# EAGLE design motionManager (EAGLE 9.0.1)
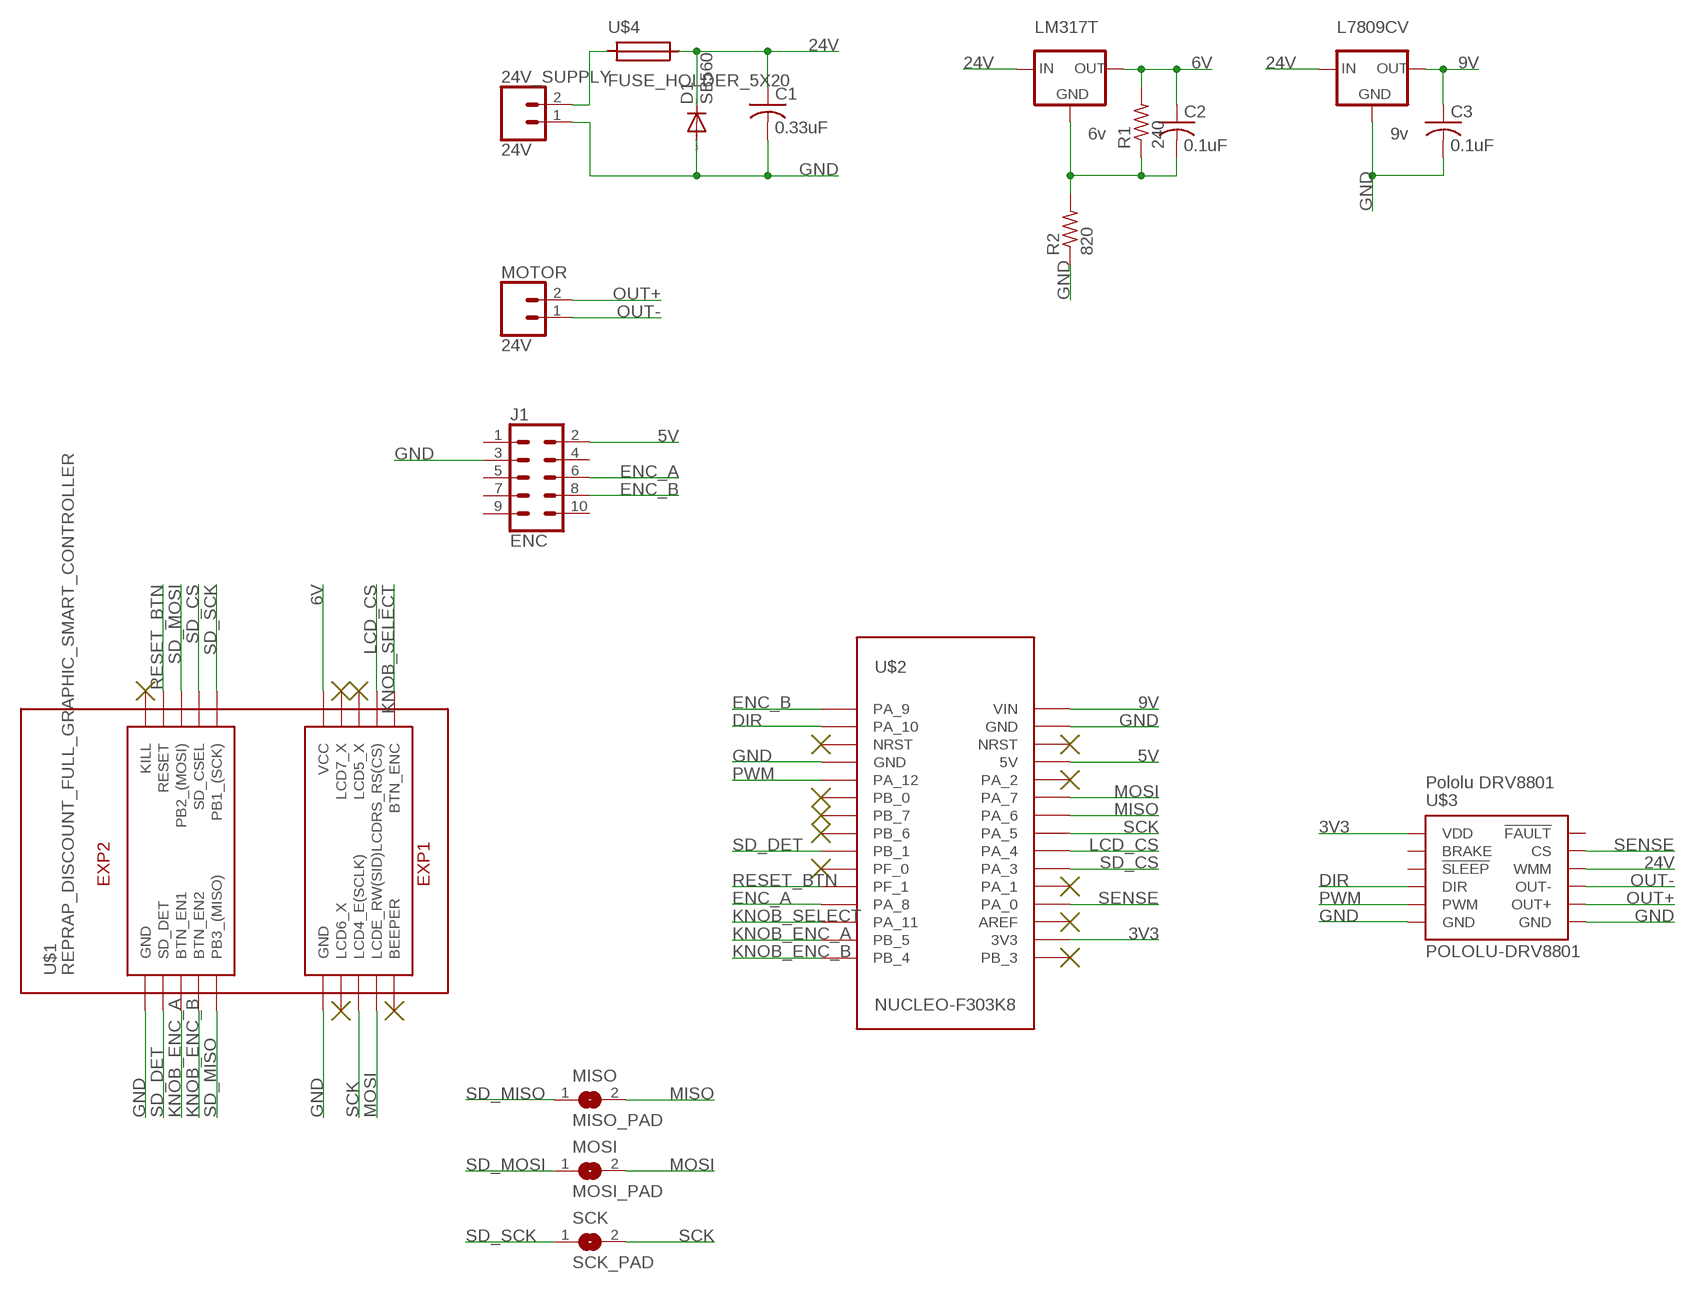
[diagram p0: schematic, sheet 1]

## Parts
24V_SUPPLY  24V  CONN_025MM  [SCREWTERMINAL-5MM-2]
C1  0.33uF  C-US025_050-055X075  [C025_050-055X075]
C2  0.1uF  C-US025_050-055X075  [C025_050-055X075]
C3  0.1uF  C-US025_050-055X075  [C025_050-055X075]
D1  SB560  SB320  [DO201-15]
J1  ENC  CONN_05X2SHD-NS  [2X5-SHROUDED-NS]
L7809CV  9v  78XXL  [78XXL]
LM317T  6v  78XXL  [78XXL]
MISO  MISO_PAD  SJW  [SJW]
MOSI  MOSI_PAD  SJW  [SJW]
MOTOR  24V  CONN_025MM  [SCREWTERMINAL-5MM-2]
R1  240  R-US_0207/7  [0207/7]
R2  820  R-US_0207/7  [0207/7]
SCK  SCK_PAD  SJW  [SJW]
U$1  REPRAP_DISCOUNT_FULL_GRAPHIC_SMART_CONTROLLER  [REPRAP_DISCOUNT_FULL_GRAPHIC_SMART_CONTROLLER]
U$2  NUCLEO-F303K8  [NUCLEO-F303K8]
U$3  POLOLU-DRV8801  [POLOLU-DRV8801]
U$4  FUSE_HOLDER_5X20  [FUSE_HOLDER_5X20]

## Nets
3V3: U$2.3V3 U$3.VDD
5V: J1.2 U$2.5V
6V: C2.1 LM317T.OUT R1.2 U$1.VCC
9V: C3.1 L7809CV.OUT U$2.VIN
24V: C1.1 D1.C L7809CV.IN LM317T.IN U$3.VMM(WMM) U$4.P$2
DIR: U$2.PA_10 U$3.DIR
ENC_A: J1.6 U$2.PA_8
ENC_B: J1.8 U$2.PA_9
GND: 24V_SUPPLY.1 C1.2 C3.2 D1.A J1.3 L7809CV.GND R2.1 U$1.GND@0(GND) U$1.GND@1(GND) U$2.GND@0(GND) U$2.GND@1(GND) U$3.GND@1(GND) U$3.GND@2(GND)
KNOB_ENC_A: U$1.BTN_EN1 U$2.PB_5
KNOB_ENC_B: U$1.BTN_EN2 U$2.PB_4
KNOB_SELECT: U$1.BTN_ENC U$2.PA_11
LCD_CS: U$1.LCDRS_RS(CS) U$2.PA_4
MISO: MISO.2 U$2.PA_6
MOSI: MOSI.2 U$1.LCDE_RW(SID) U$2.PA_7
N$2: 24V_SUPPLY.2 U$4.P$1
N$3: C2.2 LM317T.GND R1.1 R2.2
OUT+: MOTOR.2 U$3.OUT+
OUT-: MOTOR.1 U$3.OUT-
PWM: U$2.PA_12 U$3.PWM
RESET_BTN: U$1.RESET U$2.PF_1
SCK: SCK.2 U$1.LCD4_E(SCLK) U$2.PA_5
SD_CS: U$1.SD_CSEL U$2.PA_3
SD_DET: U$1.SD_DET U$2.PB_1
SD_MISO: MISO.1 U$1.PB3_(MISO)
SD_MOSI: MOSI.1 U$1.PB2_(MOSI)
SD_SCK: SCK.1 U$1.PB1_(SCK)
SENSE: U$2.PA_0 U$3.CS
Unconnected: J1.1 J1.4 J1.5 J1.7 J1.9 J1.10 U$1.BEEPER U$1.KILL U$1.LCD5_X U$1.LCD6_X U$1.LCD7_X U$2.AREF U$2.NRST@0(NRST) U$2.NRST@1(NRST) U$2.PA_1 U$2.PA_2 U$2.PB_0 U$2.PB_3 U$2.PB_6 U$2.PB_7 U$2.PF_0 U$3.!FAULT U$3.!SLEEP U$3.BRAKE

## Library data of the parts
24V_SUPPLY MOTOR = SparkFun-Connectors:CONN_02: Multi connection point. Often used as Generic Header-pin footprint for 0.1 inch spaced/style header connections On any of the 0.1 inch spaced packages, you can populate with these: Break Away Headers - Straight <https://www.sparkfun.com/products/116> (PRT-00116) Break Away Male Headers - Right Angle <https://www.sparkfun.com/products/553> (PRT-00553) Female Headers <https://www.sparkfun.com/products/115> (PRT-00115) Break Away Headers - Machine Pin <https://www.sparkfun.com/products/117> (PRT-00117) Break Away Female Headers - Swiss Machine Pin <https://www.sparkfun.com/products/743> (PRT-00743) For SCREWTERMINALS and SPRING TERMINALS visit here: Screw Terimnals on SparkFun.com <https://www.sparkfun.com/search/results?term=Screw+Terminals> (5mm/3.5mm/2.54mm spacing) This device is also useful as a general connection point to wire up your design to another part of your project. Our various solder wires solder well into these plated through hole pads. Hook-Up Wire - Assortment (Stranded, 22 AWG) <https://www.sparkfun.com/products/11375> (PRT-11375) Hook-Up Wire - Assortment (Solid Core, 22 AWG) <https://www.sparkfun.com/products/11367> (PRT-11367) View the entire wire category on our website here <https://www.sparkfun.com/categories/141> Special notes: Molex polarized connector foot print use with: PRT-08233 with associated crimp pins and housings. 2.54_SCREWTERM for use with PRT-10571. 3.5mm Screw Terminal footprints for PRT-08084 5mm Screw Terminal footprints for use with PRT-08432; SF_SKU: PRT-08432
C1-C3 = adafruit:C-US: CAPACITOR, American symbol
D1 = diode:SB320: DIODE barrier rectifier, 3 A (Fairchild)
J1 = SparkFun-Connectors:CONN_05X2: Multi connection point. Often used as Generic Header-pin footprint for 0.1 inch spaced/style header connections For AVR SPI programming port, see special device with nice symbol: "AVR_SPI_PROG_5x2.dev" You can populate with any combo of single row headers, but if you'd like an exact match, check these: 2x5 AVR ICSP Male Header <https://www.sparkfun.com/products/778> (PRT-00778) 2x5 Pin Shrouded Header <https://www.sparkfun.com/products/8506> (PRT-08506) On any of the 0.1 inch spaced packages, you can populate with these: Break Away Headers - Straight <https://www.sparkfun.com/products/116> (PRT-00116) Break Away Male Headers - Right Angle <https://www.sparkfun.com/products/553> (PRT-00553) Female Headers <https://www.sparkfun.com/products/115> (PRT-00115) Break Away Headers - Machine Pin <https://www.sparkfun.com/products/117> (PRT-00117) Break Away Female Headers - Swiss Machine Pin <https://www.sparkfun.com/products/743> (PRT-00743) Special note: the shrouded connector mates well with our 5x2 ribbon cables: 2x5 Pin IDC Ribbon Cable <https://www.sparkfun.com/products/8535> (PRT-08535); PROD_ID: CONN-08671; SF_ID: PRT-08506
L7809CV LM317T = v-reg:78XXL: VOLTAGE REGULATOR
MISO MOSI SCK = jumper:SJ: SMD solder JUMPER
R1 R2 = adafruit:R-US_: RESISTOR, American symbol
U$1 = Pamir:REPRAP_DISCOUNT_FULL_GRAPHIC_SMART_CONTROLLER
U$2 = Pamir:NUCLEO-F303K8
U$3 = Pamir:POLOLU-DRV8801: DRV8801 Single Brushed DC Motor Driver Carrier DRV8801 Single Brushed DC Motor Driver Carrier Manufacturer: Pololu Manufacturer Part Number: N/A Description: N/A Technical Specifications: N/A Digikey: N/A Mouser: N/A
U$4 = Pamir:FUSE_HOLDER_5X20

## Board
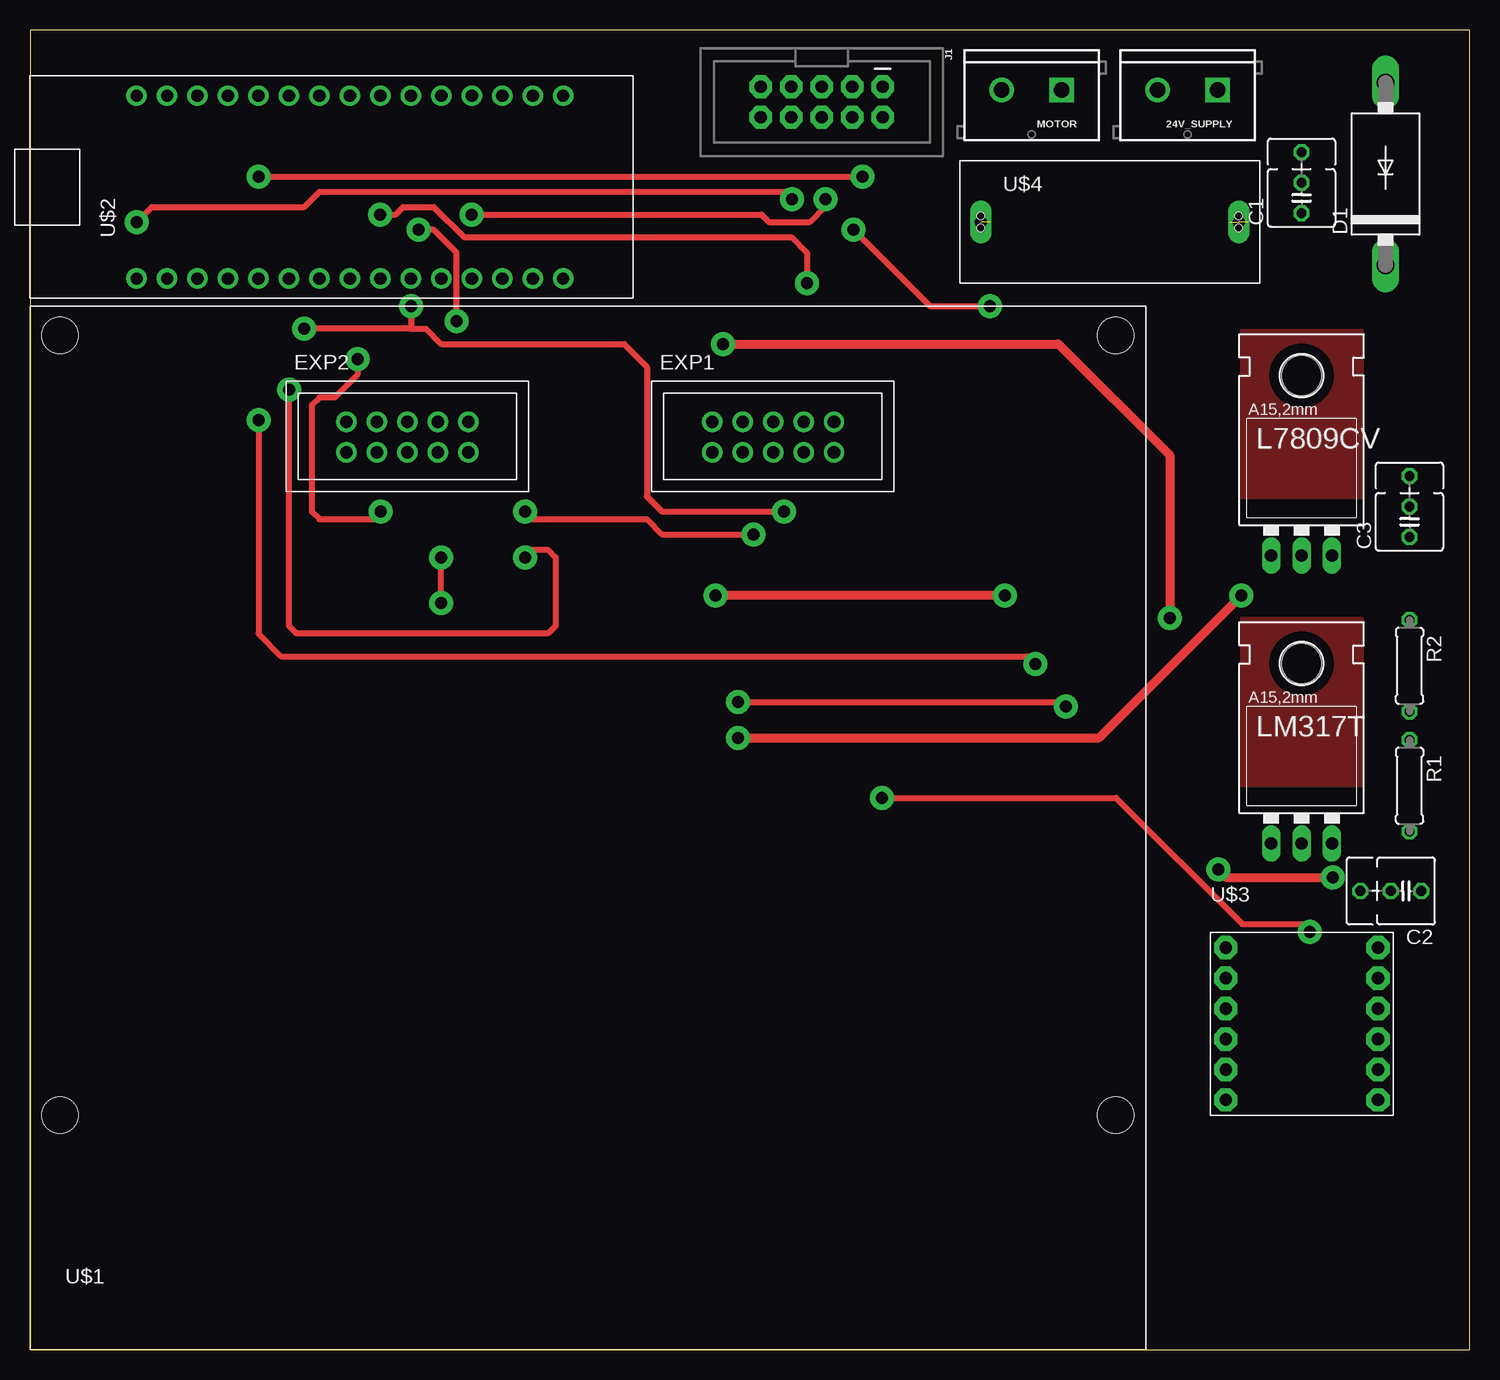
[diagram p1: board, top side]
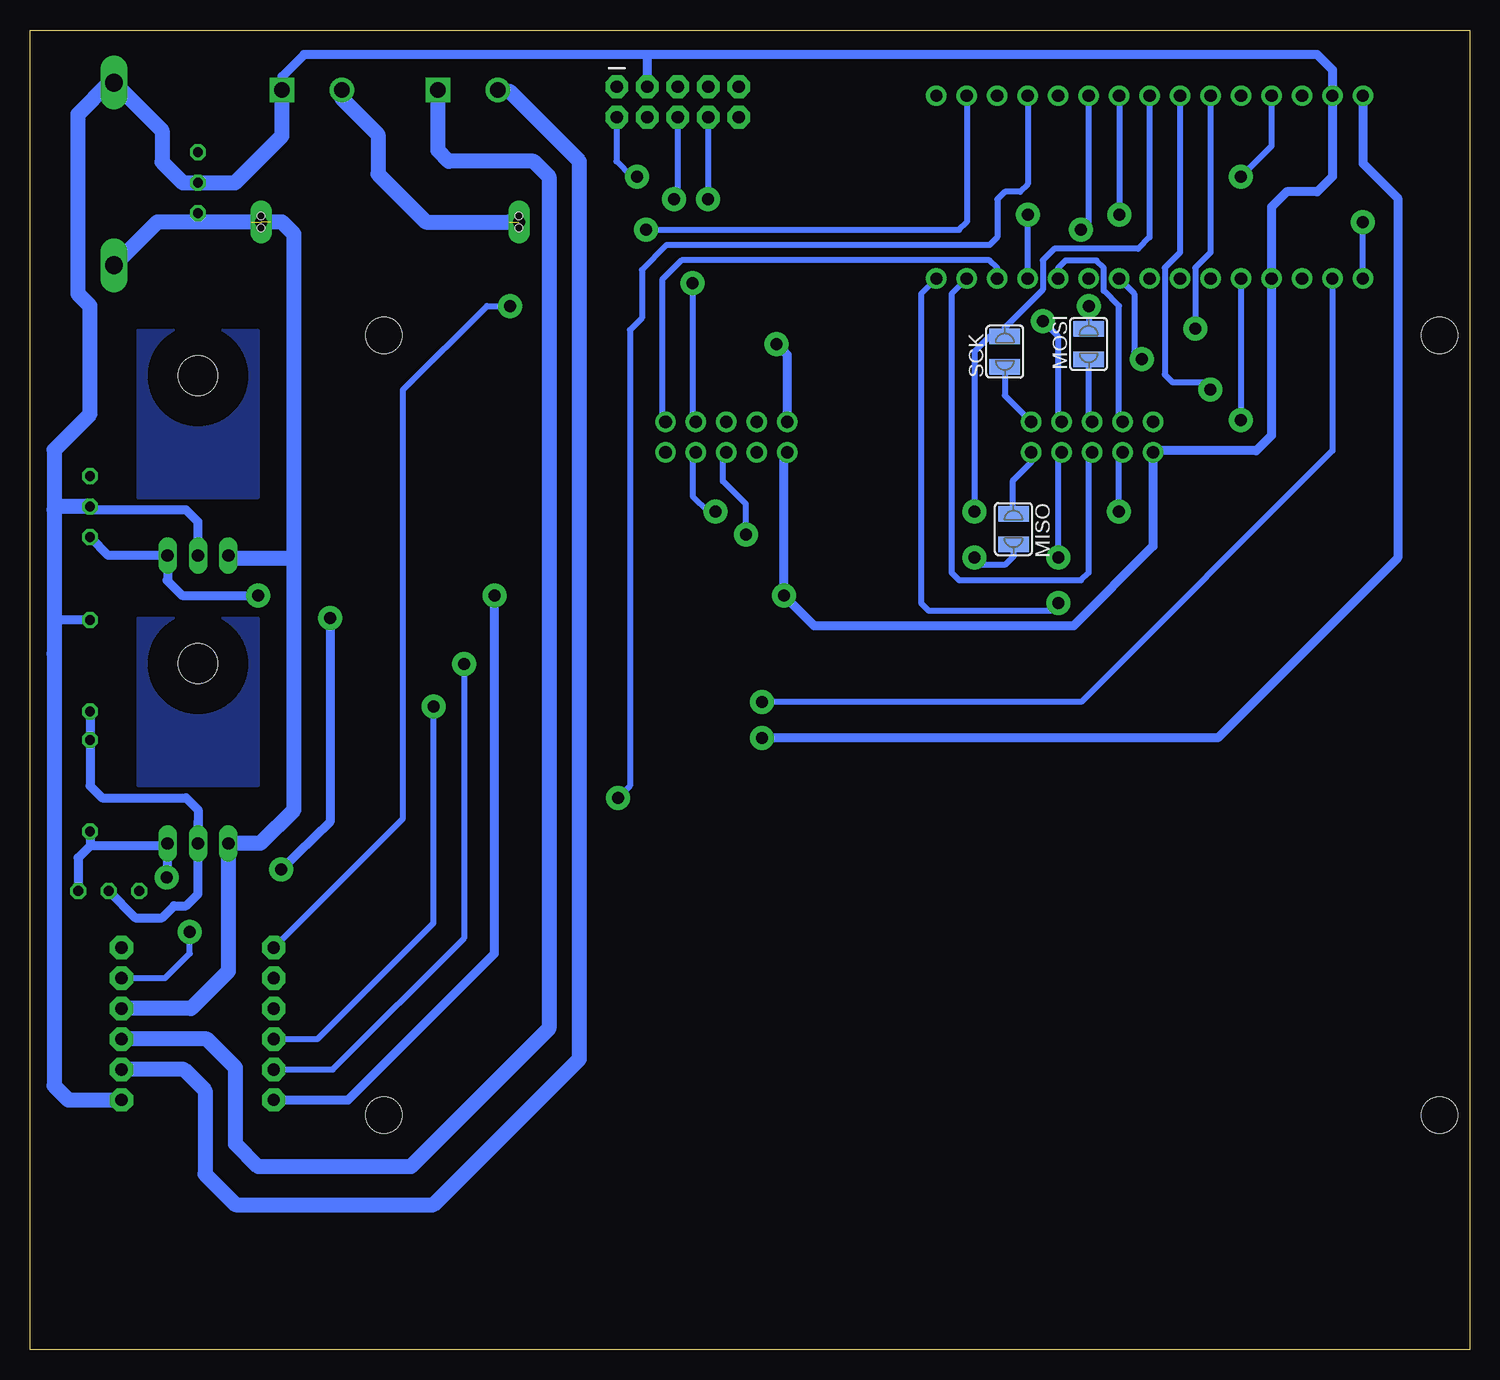
[diagram p2: board, bottom side, seen from below]

Size 120 x 110 mm. Coordinates in mm from the lower left corner, seen from the top.
Outline: 0,0 120,0 120,110 0,110 0,0
Copper layers (1*16): Top 0.035mm / dielectric 1.5mm / Bottom 0.035mm
Design rules "default *": minimum track width 6mil, minimum drill 0.35mm, track to track 6mil, track to pad 6mil, pad to pad 6mil, via to via 6mil, smd to smd 6mil, copper to edge 40mil, drill to drill 6mil, minimum pad ring 10mil, minimum via ring 8mil, stop-mask expansion 4mil, vias tented up to drill 0mil, thermal gap 10mil

### Footprints (pad centres in the part's own frame; a part is rotated, then mirrored left to right if it is on the bottom)
SCREWTERMINAL-5MM-2 = drill 1.3 pad 2.032 square: 1 0,0 | drill 1.3 pad 2.032: 2 5,0
C025_050-055X075 = drill 0.813 octagon: 1 -1.27,0; 2 1.27,0; 3 3.81,0
DO201-15 = drill 1.499 long: A 7.62,0; C -7.62,0
2X5-SHROUDED-NS = drill 1.016 pad 1.88 octagon: 1 -1.27,5.08; 2 1.27,5.08; 3 -1.27,2.54; 4 1.27,2.54; 5 -1.27,0; 6 1.27,0; 7 -1.27,-2.54; 8 1.27,-2.54; 9 -1.27,-5.08; 10 1.27,-5.08
78XXL = drill 1.016 long: GND 0,-3.81; IN -2.54,-3.81; OUT 2.54,-3.81 | hole 3.302: 0,11.176
SJW = smd 1.27 x 2.54: 1 -1.27,0; 2 1.27,0
0207/7 = drill 0.813 octagon: 1 -3.81,0; 2 3.81,0
REPRAP_DISCOUNT_FULL_GRAPHIC_SMART_CONTROLLER = drill 1.05 pad 1.7: BEEPER 20.524,31.297; BTN_EN1 -15.036,31.297; BTN_EN2 -12.496,31.297; BTN_ENC 20.524,33.837; GND@0 -20.116,31.297; GND@1 10.364,31.297; KILL -20.116,33.837; LCD4_E(SCLK) 15.444,31.297; LCD5_X 15.444,33.837; LCD6_X 12.904,31.297; LCD7_X 12.904,33.837; LCDE_RW(SID) 17.984,31.297; LCDRS_RS(CS) 17.984,33.837; PB1_(SCK) -9.956,33.837; PB2_(MOSI) -15.036,33.837; PB3_(MISO) -9.956,31.297; RESET -17.576,33.837; SD_CSEL -12.496,33.837; SD_DET -17.576,31.297; VCC 10.364,33.837 | hole 3: -44,41.037; 44,41.037; -44,-23.963; 44,-23.963
NUCLEO-F303K8 = drill 1.02 pad 1.7: 3V3 16.891,8.382; 5V 16.891,33.782; AREF 16.891,10.922; GND@0 1.651,33.782; GND@1 16.891,38.862; NRST@0 1.651,36.322; NRST@1 16.891,36.322; PA_0 16.891,13.462; PA_1 16.891,16.002; PA_2 16.891,31.242; PA_3 16.891,18.542; PA_4 16.891,21.082; PA_5 16.891,23.622; PA_6 16.891,26.162; PA_7 16.891,28.702; PA_8 1.651,13.462; PA_9 1.651,41.402; PA_10 1.651,38.862; PA_11 1.651,10.922; PA_12 1.651,31.242; PB_0 1.651,28.702; PB_1 1.651,21.082; PB_3 16.891,5.842; PB_4 1.651,5.842; PB_5 1.651,8.382; PB_6 1.651,23.622; PB_7 1.651,26.162; PF_0 1.651,18.542; PF_1 1.651,16.002; VIN 16.891,41.402
POLOLU-DRV8801 = drill 1.016 pad 1.93 octagon: !FAULT 6.35,6.35; !SLEEP -6.35,1.27; BRAKE -6.35,3.81; CS 6.35,3.81; DIR -6.35,-1.27; GND@1 -6.35,-6.35; GND@2 6.35,-6.35; OUT+ 6.35,-3.81; OUT- 6.35,-1.27; PWM -6.35,-3.81; VDD -6.35,6.35; VMM 6.35,1.27
FUSE_HOLDER_5X20 = drill 1 pad 1.8 long: P$1 -10.75,0; P$2 10.75,0 | hole 0.6: -10.75,0.5; -10.75,-0.5; 10.75,-0.5; 10.75,0.5

### Placement (x,y rotation side)
24V_SUPPLY  99,105 180 top
C1  106,96 90 top
C2  114.71,38.22 180 top
C3  115,69 90 top
D1  113,98 90 top
J1  66,104 270 top
L7809CV  106,70 0 top
LM317T  106,46 0 top
MISO  38.02,68.4 270 bottom
MOSI  31.75,83.82 90 bottom
MOTOR  86,105 180 top
R1  115,47 270 top
R2  115,57 270 top
SCK  38.73,83.19 90 bottom
U$1  46.5,43.5 0 top
U$2  50.29,87.63 90 top
U$3  106.03,27.15 0 top
U$4  90,94 0 top

### Tracks (layer width: path | path; a pad name or v marks a point on that pad's centre or on a via)
3V3  (via drill 1 pad 2)
  Top 0.508: v68.66,93.34 75,87 v80,87
  Bottom 0.508: U$2.3V3 41.91,93.98 42.55,93.34 v68.66,93.34 | U$3.VDD 88.9,44.28 88.9,80.01 81.92,87 v80,87
5V  (via drill 1 pad 2)
  Top 0.508: v19.05,97.79 v69.41,97.79
  Bottom 0.508: U$2.5V 16.51,100.33 v19.05,97.79 | v69.41,97.79 69.85,97.79 71.12,99.06 71.08,99.1 J1.2
6V  (via drill 1 pad 2)
  Top 0.762: v57.78,83.82 85.72,83.82 95,74.55 v95,61 | v99.06,40.01 99.69,39.37 v108.58,39.37
  Bottom 0.762: U$1.VCC 56.86,82.9 v57.78,83.82 | v95,61 95,44 v99.06,40.01 | v108.58,39.37 108.54,39.41 108.54,42 | 108.54,42 LM317T.OUT | R1.2 114.98,43.17 114.98,42 | 108.54,42 114.98,42 | 114.98,42 115.98,41 116,41 116,38.24 C2.1
9V  (via drill 1 pad 2)
  Top 0.762: v59,51 89.1,51 v100.97,62.87
  Bottom 0.762: v100.97,62.87 107.31,62.87 108.58,64.14 108.54,64.18 L7809CV.OUT 113.46,66.19 C3.1 | U$2.VIN 8.89,98.89 6,96 6,66 21,51 v59,51
24V  (2 unrouted)
  Bottom 1.27: 98,66 98,45 100.81,42.19 LM317T.IN 103.46,31.54 106.58,28.42 U$3.VMM | 98,66 98,93 99,94 99.93,94 | L7809CV.IN 103.27,66 98,66 | 106,94 C1.1 | 101.57,94 106,94 | D1.C 109.38,94 106,94
DIR  (via drill 1 pad 2)
  Top 0.508: v59,54 86,54 86.36,53.64 v86.36,53.61
  Bottom 0.508: U$3.DIR 96.04,25.88 86.36,35.56 v86.36,53.61 | U$2.PA_10 11.43,74.93 32.36,54 v59,54
ENC_A  (via drill 1 pad 2)
  Top 0.508: v36.83,94.61 60.96,94.61 61.59,93.98 61.62,94 65,94 66.31,95.31 v66.31,95.89
  Bottom 0.508: U$2.PA_8 36.83,93.34 v36.83,94.61 | v66.31,95.89 66,96.19 J1.6
ENC_B  (via drill 1 pad 2)
  Top 0.508: v8.89,93.98 10.16,95.25 22.86,95.25 24.13,96.52 62.87,96.52 v63.5,95.89
  Bottom 0.508: J1.8 63.5,102.69 v63.5,95.89 | U$2.PA_9 v8.89,93.98
GND  (via drill 1 pad 2)
  Top 0.762: v81.28,62.87 v57.15,62.87
  Bottom 0.508: U$2.GND@1 | 16.51,95.25 | U$2.GND@0 | 26.25,74.93 U$1.GND@0
  Bottom 0.762: U$2.GND@1 11.43,97.79 12.7,96.52 15.24,96.52 16.51,95.25 | U$1.GND@1 57.15,74.51 v57.15,62.87 54.61,60.33 33.02,60.33 26.38,66.96 U$1.GND@0 | U$3.GND@1 93.5,20.8 81.28,33.02 v81.28,62.87 | 16.51,95.25 U$2.GND@0 | U$2.GND@0 16.51,76.2 17.78,74.93 26.25,74.93 | U$2.GND@1 11.43,106.68 12.7,107.95 68.58,107.95 | 68.58,107.95 97.16,107.95 99,106.11 24V_SUPPLY.1 | 68.58,107.95 68.54,107.91 J1.3 | R2.1 117.81,60.81 118,58 | L7809CV.GND 106,69 107,70 114.73,70 C3.2
  Bottom 1.27: 118,70 118,75 115,78 115,87 116,88 116,103 113.38,105.62 D1.A 109,101.62 109,99 107.27,97.27 C1.2 102.91,97.27 99,101.17 24V_SUPPLY.1 | C3.2 117.73,70.27 118,70 | U$3.GND@2 116.8,20.8 118,22 118,58 118,70
KNOB_ENC_A
  Bottom 0.508: U$1.BTN_EN1 31.75,74.51 31.75,64.77 32.38,64.14 42.55,64.14 43.18,64.77 43.18,88.01 U$2.PB_5
KNOB_ENC_B  (via drill 1 pad 2)
  Top 0.508: v34.29,62.23 v34.29,66.04
  Bottom 0.508: U$1.BTN_EN2 34.29,74.51 v34.29,66.04 | U$2.PB_4 45.72,88.01 45.72,62.23 45.09,61.59 34.92,61.59 v34.29,62.23
KNOB_SELECT
  Bottom 0.508: U$1.BTN_ENC 67.31,77.62 67.31,89.17 65.67,90.81 40.01,90.81 39.37,90.17 U$2.PA_11
LCD_CS  (via drill 1 pad 2)
  Top 0.508: v29.21,94.62 30.48,94.62 31.11,95.25 33.66,95.25 36.2,92.71 63.5,92.71 64.77,91.44 v64.77,88.9
  Bottom 0.508: U$2.PA_4 v29.21,94.62 | U$1.LCDRS_RS(CS) 64.77,77.62 v64.77,88.9
MISO  (via drill 1 pad 2)
  Top 0.508: v41.27,66.04 41.91,66.67 43.18,66.67 43.81,66.04 43.81,60.33 43.18,59.69 22.23,59.69 21.59,60.33 v21.59,80.01
  Bottom 0.508: U$2.PA_6 24.13,91.44 25.4,90.17 25.4,81.28 24.77,80.64 22.23,80.64 v21.59,80.01 | MISO.2 38.02,66.12 38.73,65.41 40.64,65.41 v41.27,66.04
MOSI  (via drill 1 pad 2)
  Top 0.508: MOSI.2 v22.86,85.09 | v31.75,87 MOSI.2 | MOSI.2 33.02,85.09 34.29,83.82 49.53,83.82 51.44,81.92 51.44,71.12 52.7,69.85 v62.87,69.85
  Bottom 0.508: U$1.LCDE_RW(SID) 64.77,74.51 64.77,71.12 63.5,69.85 v62.87,69.85 | U$2.PA_7 21.59,93.98 | 21.59,93.98 | 21.59,93.98 21.59,91.44 22.86,90.17 v22.86,85.09 | v31.75,87 MOSI.2
N$1
  pour Top: 101,61 111,61 111,47 101,47
N$2  (1 unrouted)
  Bottom 1.27: 24V_SUPPLY.2 94,104.28 91,101.28 91,98 87,94 80.07,94
N$3
  Bottom 0.762: LM317T.GND 106,44 | C2.2 111.22,36 109,36 108,37 107,37 106,38 LM317T.GND | R2.2 R1.1 115,47 114,46 107,46 106,45 LM317T.GND
N$4
  pour Bottom: 101,61 101,47 111,47 111,61
N$5
  pour Top: 101,85 111,85 111,71 101,71
N$6
  pour Bottom: 101,71 111,71 111,85 101,85
OUT+
  Bottom 1.27: U$3.OUT+ 107.16,23.34 105.41,21.59 105.41,14.61 102.87,12.06 86.36,12.06 74.2,24.23 74.2,99.06 80,104.86 MOTOR.2
OUT-
  Bottom 1.27: U$3.OUT- 105.25,25.88 102.87,23.5 102.87,17.14 100.97,15.24 88.27,15.24 76.74,26.77 76.74,97.79 78.01,99.06 85.09,99.06 86,99.97 MOTOR.1
PWM  (via drill 1 pad 2)
  Top 0.508: v19.05,77.47 19.05,59.69 20.95,57.78 83.19,57.78 v83.82,57.15
  Bottom 0.508: U$3.PWM 94.77,23.34 83.82,34.29 v83.82,57.15 | U$2.PA_12 v19.05,77.47
RESET_BTN
  Bottom 0.508: U$1.RESET 29.21,77.62 29.21,87 30.48,88.27 30.48,90.17 31.09,90.78 33.68,90.78 34.29,90.17 U$2.PF_1
SCK  (via drill 1 pad 2)
  Top 0.508: v41.27,69.85 41.91,69.22 51.44,69.22 52.7,67.94 v60.33,67.94
  Bottom 0.508: U$2.PA_5 26.67,93.98 | 26.67,93.98 | 26.67,93.98 26.67,92.71 27.62,91.76 34.61,91.76 35.57,90.79 35.57,88.34 38.73,85.17 SCK.2 40.01,84.45 41.27,83.19 v41.27,69.85 | v60.33,67.94 60.33,70.48 62.23,72.39 62.23,74.51 U$1.LCD4_E(SCLK)
SD_CS  (via drill 1 pad 2)
  Top 0.508: v35.56,85.72 35.56,91.44 33.66,93.34 v32.38,93.34
  Bottom 0.508: U$2.PA_3 31.75,93.98 v32.38,93.34 | U$1.SD_CSEL 34.29,77.62 34.29,84.45 v35.56,85.72
SD_DET  (via drill 1 pad 2)
  Top 0.508: v27.3,82.55 27.3,81.28 25.4,79.38 24.13,79.38 23.5,78.74 23.5,69.85 24.13,69.22 28.57,69.22 v29.21,69.85
  Bottom 0.508: U$2.PB_1 27.94,88.01 27.94,83.19 v27.3,82.55 | U$1.SD_DET 29.21,74.51 v29.21,69.85
SD_MISO
  Bottom 0.508: U$1.PB3_(MISO) 36.54,73.95 38.1,72.39 38.1,69.75 MISO.1
SD_MOSI
  Bottom 0.508: U$1.PB2_(MOSI) 31.75,77.62 MOSI.1
SD_SCK
  Bottom 0.508: SCK.1 38.73,79.53 U$1.PB1_(SCK)
SENSE  (via drill 1 pad 2)
  Top 0.508: v106.68,34.83 106.05,35.47 101.06,35.47 90.53,46 v71,46
  Bottom 0.508: U$3.CS 108.74,30.96 106.68,33.02 v106.68,34.83 | U$2.PA_0 36.83,97.16 37.47,96.52 38.73,96.52 39.37,95.89 39.37,92.71 40.01,92.08 66.92,92.08 69,90 69,86 70,85 70,47 v71,46